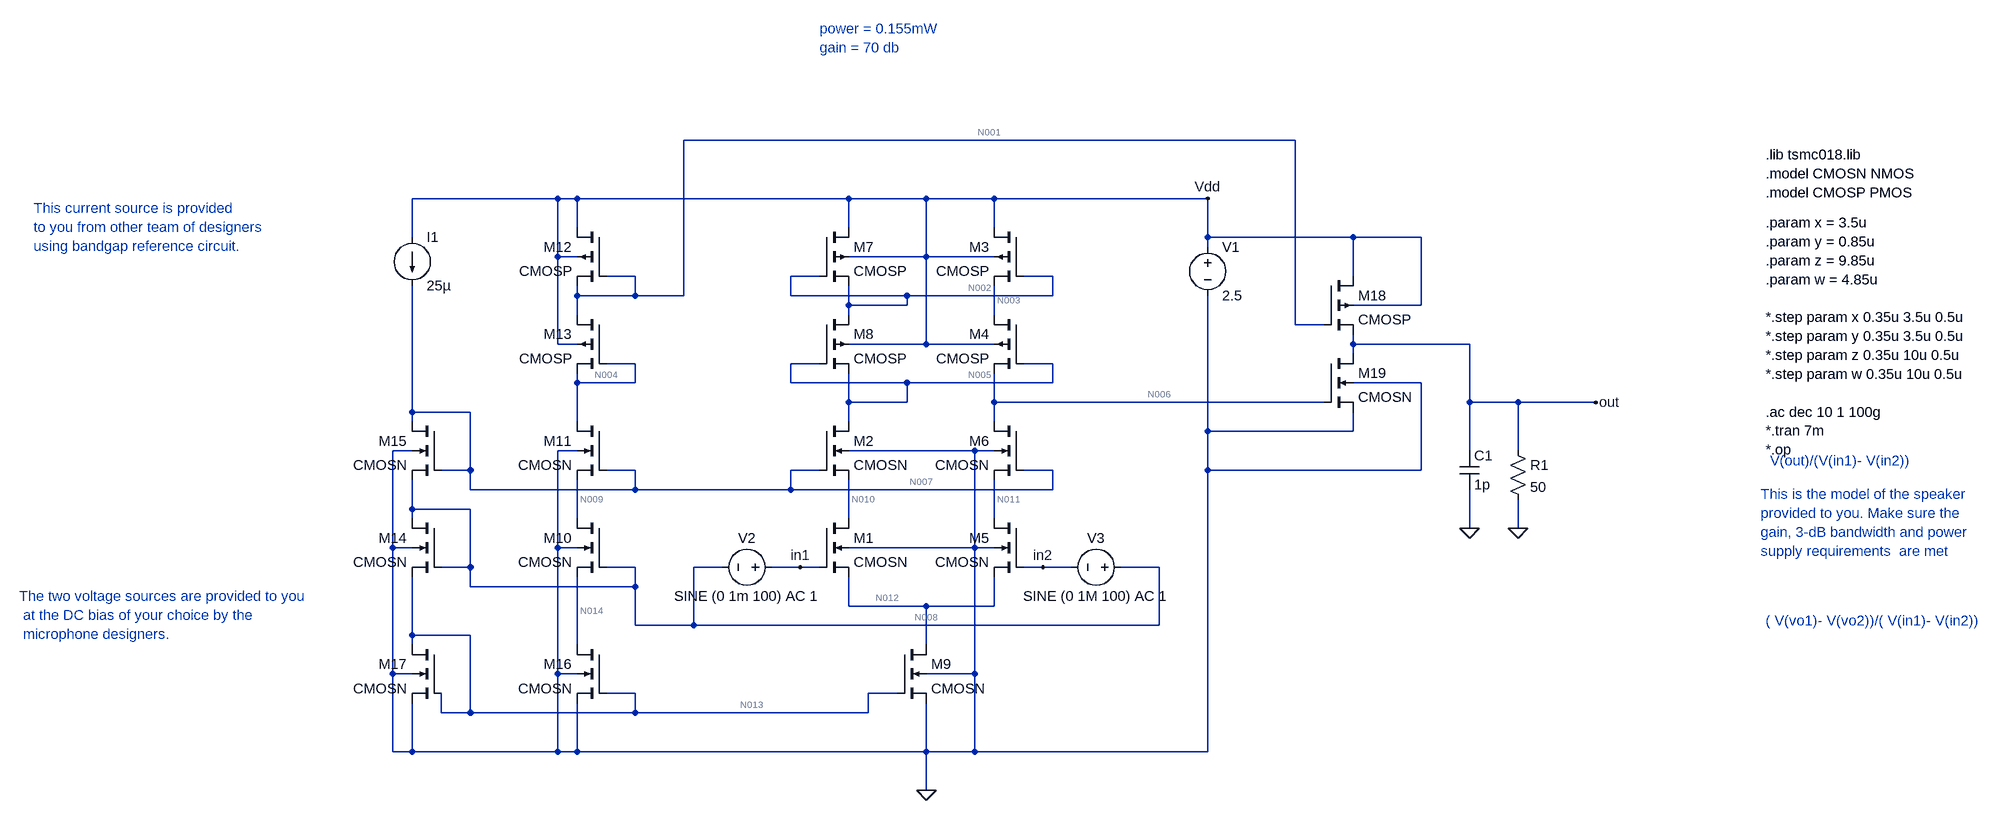
[diagram p0: schematic 2018A3PS0095P.asc]
2018A3PS0095P.asc, the LTspice schematic file:
Version 4
SHEET 1 1216 1048
WIRE -16 -176 -1024 -176
WIRE -1232 -80 -1472 -80
WIRE -1200 -80 -1232 -80
WIRE -752 -80 -1200 -80
WIRE -624 -80 -752 -80
WIRE -512 -80 -624 -80
WIRE -160 -80 -512 -80
WIRE -1200 -32 -1200 -80
WIRE -752 -32 -752 -80
WIRE -512 -32 -512 -80
WIRE -1472 -16 -1472 -80
WIRE -160 -16 -160 -80
WIRE 80 -16 -160 -16
WIRE 192 -16 80 -16
WIRE -160 0 -160 -16
WIRE -1232 16 -1232 -80
WIRE -1200 16 -1232 16
WIRE -624 16 -624 -80
WIRE -624 16 -752 16
WIRE -512 16 -624 16
WIRE -1104 48 -1152 48
WIRE -800 48 -848 48
WIRE -416 48 -464 48
WIRE 80 48 80 -16
WIRE -1200 80 -1200 64
WIRE -1104 80 -1104 48
WIRE -1104 80 -1200 80
WIRE -1024 80 -1024 -176
WIRE -1024 80 -1104 80
WIRE -848 80 -848 48
WIRE -656 80 -848 80
WIRE -416 80 -416 48
WIRE -416 80 -656 80
WIRE -752 96 -752 64
WIRE -656 96 -656 80
WIRE -656 96 -752 96
WIRE 192 96 192 -16
WIRE 192 96 80 96
WIRE -1200 112 -1200 80
WIRE -752 112 -752 96
WIRE -512 112 -512 64
WIRE -16 128 -16 -176
WIRE 32 128 -16 128
WIRE -1232 160 -1232 16
WIRE -1200 160 -1232 160
WIRE -624 160 -624 16
WIRE -624 160 -752 160
WIRE -512 160 -624 160
WIRE 80 160 80 144
WIRE 272 160 80 160
WIRE 80 176 80 160
WIRE -1104 192 -1152 192
WIRE -800 192 -848 192
WIRE -416 192 -464 192
WIRE -1200 224 -1200 208
WIRE -1104 224 -1104 192
WIRE -1104 224 -1200 224
WIRE -848 224 -848 192
WIRE -656 224 -848 224
WIRE -416 224 -416 192
WIRE -416 224 -656 224
WIRE 192 224 80 224
WIRE -752 256 -752 208
WIRE -656 256 -656 224
WIRE -656 256 -752 256
WIRE -512 256 -512 208
WIRE 32 256 -512 256
WIRE 272 256 272 160
WIRE 352 256 272 256
WIRE 480 256 352 256
WIRE -1472 272 -1472 64
WIRE -1376 272 -1472 272
WIRE -1472 288 -1472 272
WIRE -1200 288 -1200 224
WIRE -752 288 -752 256
WIRE -512 288 -512 256
WIRE -160 304 -160 80
WIRE 80 304 80 272
WIRE 80 304 -160 304
WIRE -1472 336 -1504 336
WIRE -1200 336 -1232 336
WIRE -544 336 -752 336
WIRE -512 336 -544 336
WIRE 272 336 272 256
WIRE 352 336 352 256
WIRE -1376 368 -1376 272
WIRE -1376 368 -1424 368
WIRE -1104 368 -1152 368
WIRE -800 368 -848 368
WIRE -416 368 -464 368
WIRE -160 368 -160 304
WIRE 192 368 192 224
WIRE 192 368 -160 368
WIRE -1376 400 -1376 368
WIRE -1104 400 -1104 368
WIRE -1104 400 -1376 400
WIRE -848 400 -848 368
WIRE -848 400 -1104 400
WIRE -416 400 -416 368
WIRE -416 400 -848 400
WIRE -1472 432 -1472 384
WIRE -1376 432 -1472 432
WIRE -1472 448 -1472 432
WIRE -1200 448 -1200 384
WIRE -752 448 -752 384
WIRE -512 448 -512 384
WIRE 272 464 272 400
WIRE 352 464 352 416
WIRE -1504 496 -1504 336
WIRE -1472 496 -1504 496
WIRE -1232 496 -1232 336
WIRE -1200 496 -1232 496
WIRE -544 496 -544 336
WIRE -544 496 -752 496
WIRE -512 496 -544 496
WIRE -1376 528 -1376 432
WIRE -1376 528 -1424 528
WIRE -1104 528 -1152 528
WIRE -960 528 -1008 528
WIRE -832 528 -880 528
WIRE -800 528 -832 528
WIRE -432 528 -464 528
WIRE -384 528 -432 528
WIRE -240 528 -304 528
WIRE -1376 560 -1376 528
WIRE -1104 560 -1104 528
WIRE -1104 560 -1376 560
WIRE -752 592 -752 544
WIRE -624 592 -752 592
WIRE -512 592 -512 544
WIRE -512 592 -624 592
WIRE -1104 624 -1104 560
WIRE -1008 624 -1008 528
WIRE -1008 624 -1104 624
WIRE -240 624 -240 528
WIRE -240 624 -1008 624
WIRE -1472 640 -1472 544
WIRE -1376 640 -1472 640
WIRE -1472 656 -1472 640
WIRE -1200 656 -1200 544
WIRE -624 656 -624 592
WIRE -1504 704 -1504 496
WIRE -1472 704 -1504 704
WIRE -1232 704 -1232 496
WIRE -1200 704 -1232 704
WIRE -544 704 -544 496
WIRE -544 704 -624 704
WIRE -1104 736 -1152 736
WIRE -672 736 -720 736
WIRE -1424 768 -1424 736
WIRE -1376 768 -1376 640
WIRE -1376 768 -1424 768
WIRE -1104 768 -1104 736
WIRE -1104 768 -1376 768
WIRE -720 768 -720 736
WIRE -720 768 -1104 768
WIRE -1504 832 -1504 704
WIRE -1472 832 -1472 752
WIRE -1472 832 -1504 832
WIRE -1232 832 -1232 704
WIRE -1232 832 -1472 832
WIRE -1200 832 -1200 752
WIRE -1200 832 -1232 832
WIRE -624 832 -624 752
WIRE -624 832 -1200 832
WIRE -544 832 -544 704
WIRE -544 832 -624 832
WIRE -160 832 -160 368
WIRE -160 832 -544 832
WIRE -624 896 -624 832
FLAG -624 896 0
FLAG -160 -80 Vdd
FLAG 352 464 0
FLAG 480 256 out
FLAG -832 528 in1
FLAG -432 528 in2
FLAG 272 464 0
SYMBOL nmos4 -800 448 R0
SYMATTR InstName M1
SYMATTR Value CMOSN
SYMATTR Value2 l=0.35u w={x}
SYMBOL nmos4 -800 288 R0
SYMATTR InstName M2
SYMATTR Value CMOSN
SYMATTR Value2 l=0.35u w={x}
SYMBOL nmos4 -464 448 M0
SYMATTR InstName M5
SYMATTR Value CMOSN
SYMATTR Value2 l=0.35u w={x}
SYMBOL nmos4 -464 288 M0
SYMATTR InstName M6
SYMATTR Value CMOSN
SYMATTR Value2 l=0.35u w={x}
SYMBOL voltage -160 -16 R0
WINDOW 123 0 0 Left 0
WINDOW 39 0 0 Left 0
SYMATTR InstName V1
SYMATTR Value 2.5
SYMBOL current -1472 -16 R0
WINDOW 123 0 0 Left 0
WINDOW 39 0 0 Left 0
SYMATTR InstName I1
SYMATTR Value 25µ
SYMBOL nmos4 -672 656 R0
SYMATTR InstName M9
SYMATTR Value CMOSN
SYMATTR Value2 l=0.35u w={2*x}
SYMBOL nmos4 -1152 448 M0
SYMATTR InstName M10
SYMATTR Value CMOSN
SYMATTR Value2 l=0.35u w={2*x}
SYMBOL nmos4 -1152 288 M0
SYMATTR InstName M11
SYMATTR Value CMOSN
SYMATTR Value2 l=0.35u w={2*x}
SYMBOL nmos4 -1424 448 M0
SYMATTR InstName M14
SYMATTR Value CMOSN
SYMATTR Value2 l=0.35u w={2*x}
SYMBOL nmos4 -1424 288 M0
SYMATTR InstName M15
SYMATTR Value CMOSN
SYMATTR Value2 l=0.35u w={2*x}
SYMBOL nmos4 -1152 656 M0
SYMATTR InstName M16
SYMATTR Value CMOSN
SYMATTR Value2 l=0.35u w={2*x}
SYMBOL nmos4 -1424 656 M0
SYMATTR InstName M17
SYMATTR Value CMOSN
SYMATTR Value2 l=0.35u w={2*x}
SYMBOL pmos4 -464 -32 M0
SYMATTR InstName M3
SYMATTR Value CMOSP
SYMATTR Value2 l=0.35u w={y}
SYMBOL pmos4 -464 112 M0
SYMATTR InstName M4
SYMATTR Value CMOSP
SYMATTR Value2 l=0.35u w={y}
SYMBOL pmos4 -800 -32 R0
SYMATTR InstName M7
SYMATTR Value CMOSP
SYMATTR Value2 l=0.35u w={y}
SYMBOL pmos4 -800 112 R0
SYMATTR InstName M8
SYMATTR Value CMOSP
SYMATTR Value2 l=0.35u w={y}
SYMBOL pmos4 -1152 -32 M0
SYMATTR InstName M12
SYMATTR Value CMOSP
SYMATTR Value2 l=0.35u w={2*y}
SYMBOL pmos4 -1152 112 M0
SYMATTR InstName M13
SYMATTR Value CMOSP
SYMATTR Value2 l=0.35u w={2*y}
SYMBOL cap 256 336 R0
SYMATTR InstName C1
SYMATTR Value 1p
SYMBOL voltage -864 528 R90
WINDOW 0 -32 56 VBottom 2
WINDOW 3 32 56 VTop 2
SYMATTR InstName V2
SYMATTR Value SINE (0 1m 100) AC 1
SYMBOL voltage -288 528 R90
WINDOW 0 -32 56 VBottom 2
WINDOW 3 32 56 VTop 2
SYMATTR InstName V3
SYMATTR Value SINE (0 1M 100) AC 1
SYMBOL res 336 320 R0
SYMATTR InstName R1
SYMATTR Value 50
SYMBOL pmos4 32 48 R0
SYMATTR InstName M18
SYMATTR Value CMOSP
SYMATTR Value2 l=0.35u w={w}
SYMBOL nmos4 32 176 R0
SYMATTR InstName M19
SYMATTR Value CMOSN
SYMATTR Value2 l=0.35u w={z}
TEXT -2120 576 Left 2 ;The two voltage sources are provided to you\n at the DC bias of your choice by the\n microphone designers.
TEXT 752 408 Left 2 ;This is the model of the speaker\nprovided to you. Make sure the\ngain, 3-dB bandwidth and power\nsupply requirements  are met
TEXT -2096 -64 Left 2 ;This current source is provided \nto you from other team of designers \nusing bandgap reference circuit.
TEXT 760 -152 Left 2 !.lib tsmc018.lib\n.model CMOSN NMOS\n.model CMOSP PMOS
TEXT 760 -40 Left 2 !.param x = 3.5u\n.param y = 0.85u\n.param z = 9.85u\n.param w = 4.85u\n \n*.step param x 0.35u 3.5u 0.5u\n*.step param y 0.35u 3.5u 0.5u\n*.step param z 0.35u 10u 0.5u\n*.step param w 0.35u 10u 0.5u\n \n.ac dec 10 1 100g\n*.tran 7m\n*.op
TEXT 768 352 Left 2 ;V(out)/(V(in1)- V(in2))
TEXT 760 616 Left 2 ;( V(vo1)- V(vo2))/( V(in1)- V(in2))
TEXT -800 -360 Left 2 ;power = 0.155mW\ngain = 70 db

The netlist it stands for:
* 2018A3PS0095P.asc
M1 N010 in1 N012 0 CMOSN l=0.35u w={x}
M2 N005 N007 N010 0 CMOSN l=0.35u w={x}
M5 N011 in2 N012 0 CMOSN l=0.35u w={x}
M6 N006 N007 N011 0 CMOSN l=0.35u w={x}
V1 Vdd 0 2.5
I1 Vdd N007 25µ
M9 N012 N013 0 0 CMOSN l=0.35u w={2*x}
M10 N009 N008 N014 0 CMOSN l=0.35u w={2*x}
M11 N004 N007 N009 0 CMOSN l=0.35u w={2*x}
M14 N008 N008 N013 0 CMOSN l=0.35u w={2*x}
M15 N007 N007 N008 0 CMOSN l=0.35u w={2*x}
M16 N014 N013 0 0 CMOSN l=0.35u w={2*x}
M17 N013 N013 0 0 CMOSN l=0.35u w={2*x}
M3 Vdd N002 N003 Vdd CMOSP l=0.35u w={y}
M4 N003 N005 N006 Vdd CMOSP l=0.35u w={y}
M7 Vdd N002 N002 Vdd CMOSP l=0.35u w={y}
M8 N002 N005 N005 Vdd CMOSP l=0.35u w={y}
M12 Vdd N001 N001 Vdd CMOSP l=0.35u w={2*y}
M13 N001 N004 N004 Vdd CMOSP l=0.35u w={2*y}
C1 out 0 1p
V2 in1 N008 SINE (0 1m 100) AC 1
V3 N008 in2 SINE (0 1M 100) AC 1
R1 out 0 50
M18 Vdd N001 out Vdd CMOSP l=0.35u w={w}
M19 out N006 0 0 CMOSN l=0.35u w={z}
.model NMOS NMOS
.model PMOS PMOS
.lib standard.mos
* The two voltage sources are provided to you
*  at the DC bias of your choice by the
*  microphone designers.
* This is the model of the speaker
* provided to you. Make sure the
* gain, 3-dB bandwidth and power
* supply requirements  are met
* This current source is provided
* to you from other team of designers
* using bandgap reference circuit.
.lib tsmc018.lib
.model CMOSN NMOS
.model CMOSP PMOS
.param x = 3.5u
.param y = 0.85u
.param z = 9.85u
.param w = 4.85u
*.step param x 0.35u 3.5u 0.5u
*.step param y 0.35u 3.5u 0.5u
*.step param z 0.35u 10u 0.5u
*.step param w 0.35u 10u 0.5u
.ac dec 10 1 100g
*.tran 7m
*.op
* V(out)/(V(in1)- V(in2))
* ( V(vo1)- V(vo2))/( V(in1)- V(in2))
* power = 0.155mW
* gain = 70 db
.backanno
.end

* Results of the author's LTspice run, read from the files saved beside the schematic
* Operating Point, zero values left out:
*   V(n010) = 707.1 mV
*   V(in1) = 707.1 mV
*   V(n012) = 353.6 mV
*   V(n005) = 1.065 V
*   V(n007) = 1.061 V
*   V(n011) = 707.1 mV
*   V(in2) = 707.1 mV
*   V(n006) = 1.065 V
*   V(vdd) = 2.5 V
*   V(n013) = 353.6 mV
*   V(n009) = 707.1 mV
*   V(n008) = 707.1 mV
*   V(n014) = 353.6 mV
*   V(n004) = 1.065 V
*   V(n002) = 1.783 V
*   V(n003) = 1.783 V
*   V(n001) = 1.783 V
*   V(out) = 3.463 mV
*   Id(M18) = 71.32 µA
*   Ib(M18) = 2.507 pA
*   Is(M18) = -71.32 µA
*   Id(M13) = 25 µA
*   Ib(M13) = 2.172 pA
*   Is(M13) = -25 µA
*   Id(M12) = 25 µA
*   Is(M12) = -25 µA
*   Id(M8) = 12.5 µA
*   Ib(M8) = 2.172 pA
*   Is(M8) = -12.5 µA
*   Id(M7) = 12.5 µA
*   Is(M7) = -12.5 µA
*   Id(M4) = 12.5 µA
*   Ib(M4) = 2.172 pA
*   Is(M4) = -12.5 µA
*   Id(M3) = 12.5 µA
*   Is(M3) = -12.5 µA
*   Id(M19) = 2.073 µA
*   Is(M19) = -2.073 µA
*   Id(M17) = 25 µA
*   Is(M17) = -25 µA
*   Id(M16) = 25 µA
*   Is(M16) = -25 µA
*   Id(M15) = 25 µA
*   Ib(M15) = -1.788 pA
*   Is(M15) = -25 µA
*   Id(M14) = 25 µA
*   Ib(M14) = -1.081 pA
*   Is(M14) = -25 µA
*   Id(M11) = 25 µA
*   Ib(M11) = -1.792 pA
*   Is(M11) = -25 µA
*   Id(M10) = 25 µA
*   Ib(M10) = -1.081 pA
*   Is(M10) = -25 µA
*   Id(M9) = 25 µA
*   Is(M9) = -25 µA
*   Id(M6) = 12.5 µA
*   Ib(M6) = -1.792 pA
*   Is(M6) = -12.5 µA
*   Id(M5) = 12.5 µA
*   Ib(M5) = -1.081 pA
*   Is(M5) = -12.5 µA
*   Id(M2) = 12.5 µA
*   Ib(M2) = -1.792 pA
*   Is(M2) = -12.5 µA
*   Id(M1) = 12.5 µA
*   Ib(M1) = -1.081 pA
*   Is(M1) = -12.5 µA
*   I(I1) = 25 µA
*   I(R1) = 69.25 µA
*   I(V1) = -146.3 µA
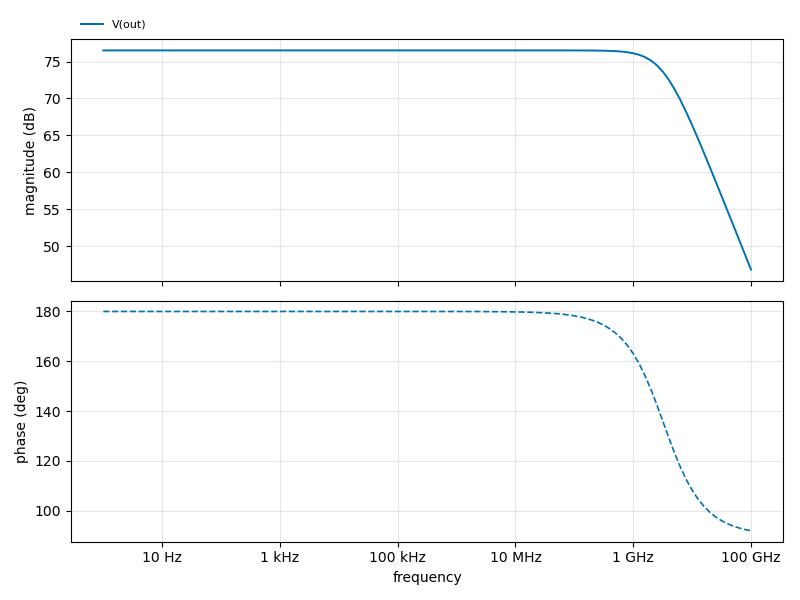
[diagram p1: AC Analysis of 2018A3PS0095P.asc, plotted from the saved traces]
* AC Analysis, 1 run:
*   V(out): 76.51 dB at 1 Hz, 46.82 dB at 100 GHz, peak 76.51 dB at 1 Hz, 3 dB below the peak at 3.268 GHz